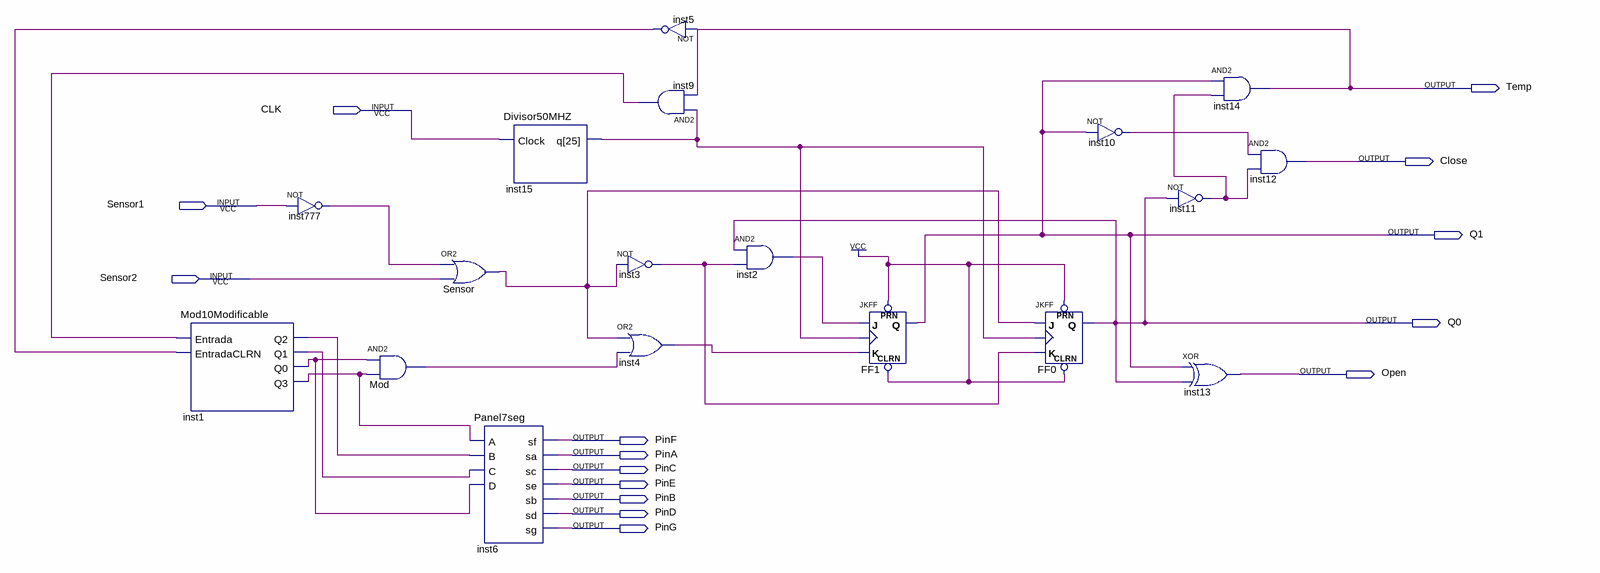
[diagram p0: schematic sheet]
// Quartus schematic ProyectoFinal.bdf as structural Verilog: 18 symbols, 15 pins
module ProyectoFinal (
  input  CLK,
  input  Sensor1,
  input  Sensor2,
  output Temp,
  output Close,
  output Q1,
  output Q0,
  output Open,
  output PinF,
  output PinA,
  output PinC,
  output PinE,
  output PinB,
  output PinD,
  output PinG
);

  wire inst1_q0, inst1_q1, inst1_q2, inst1_q3, inst2_out, inst3_out, inst4_out, inst5_out, inst9_out,
       inst10_out, inst11_out, inst15_q, inst777_out, Mod_out, Sensor_out;

  Mod10Modificable inst1 (
    .Entrada(inst9_out), .EntradaCLRN(inst5_out), .Q2(inst1_q2), .Q1(inst1_q1), .Q0(inst1_q0), .Q3(inst1_q3));
  not inst777 (inst777_out, Sensor1);
  and Mod (Mod_out, inst1_q0, inst1_q3);
  or Sensor (Sensor_out, inst777_out, Sensor2);
  Divisor50MHZ inst15 (.Clock(CLK), .q(inst15_q));
  Panel7seg inst6 (
    .A(inst1_q3), .B(inst1_q2), .C(inst1_q1), .D(inst1_q0), .sf(PinF), .sa(PinA), .sc(PinC), .se(PinE),
    .sb(PinB), .sd(PinD), .sg(PinG));
  and inst9 (inst9_out, inst15_q, Temp);
  not inst3 (inst3_out, Sensor_out);
  or inst4 (inst4_out, Sensor_out, Mod_out);
  not inst5 (inst5_out, Temp);
  and inst2 (inst2_out, Q0, inst3_out);
  JKFF FF1 (.PRN(1'b1), .CLRN(1'b1), .K(inst4_out), .J(inst2_out), .CLK(inst15_q), .Q(Q1));
  JKFF FF0 (.PRN(1'b1), .CLRN(1'b1), .K(inst3_out), .J(Sensor_out), .CLK(inst15_q), .Q(Q0));
  not inst10 (inst10_out, Q1);
  not inst11 (inst11_out, Q0);
  and inst14 (Temp, Q1, inst11_out);
  xor inst13 (Open, Q1, Q0);
  and inst12 (Close, inst10_out, inst11_out);
endmodule
